# EAGLE schematic discover (EAGLE 7.4.0)
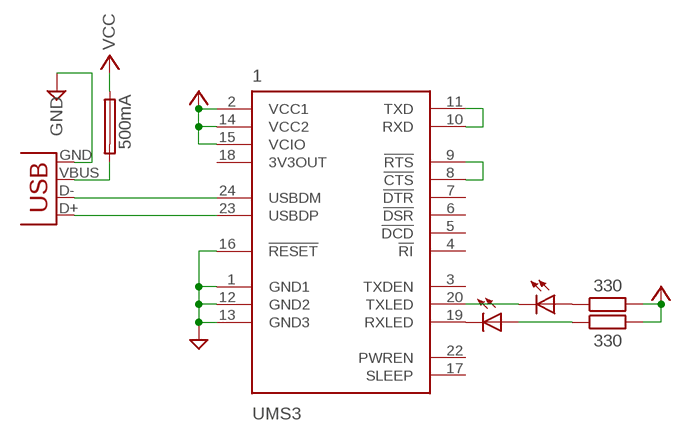
[diagram p0: schematic, sheet 1]

## Parts
1  UMS3  [DIL-24]
F1  500mA  GSH15  [GSH15]
R1  330  R-EU_0411/12  [0411/12]
R2  330  R-EU_0411/12  [0411/12]
RLED  LED3MM  [LED3MM]
TLED  LED3MM  [LED3MM]
X1  USB-PTH  [USB-B-PTH]

## Nets
GND: 1.1(GND1) 1.12(GND2) 1.13(GND3) 1.16(!RESET) X1.GND
N$1: 1.24(USBDM) X1.D-
N$2: 1.23(USBDP) X1.D+
N$3: 1.10(RXD) 1.11(TXD)
N$4: F1.2 X1.VBUS
N$5: 1.20(TXLED) TLED.K(C)
N$6: R1.1 RLED.A
N$7: 1.19(RXLED) RLED.K(C)
N$8: R2.1 TLED.A
N$9: 1.8(!CTS) 1.9(!RTS)
VCC: 1.2(VCC1) 1.14(VCC2) 1.15(VCIO) F1.1 R1.2 R2.2
Unconnected: 1.3(TXDEN) 1.4(!RI) 1.5(!DCD) 1.6(!DSR) 1.7(!DTR) 1.17(SLEEP) 1.18(3V3OUT) 1.22(PWREN)

## Library data of the parts
1 = ftdichip:UMS: Asix - UMS USB-UART Wrapper Module UMS3 is an USB->Serial interface module based on the powerful FT232RL chip made by FTDI. It enables very easy connection of the user's application to the PC via the USB port, without necessity of any deep knowledge about the complicated USB problematics. On the USB side of UMS3 there are 2 signals D+ and D-, on the opposite side there are the serial port signals (in the TTL level) with full data flow control. UMS3 is capable to transfer data at speeds up to 3 MBaud. UMS3 contains the on-chip EEPROM for storing the ID data (VID, PID, ID string) and the non-rewritable unique Serial number. UMS3 is manufactured as a DIP24 device with standard pin distance of 2.54 mm (0.1"). It can be put into standard or precision DIP socket or it can be directly soldered to user application PCB. It saves time and money in small medium volume production. The USB connector is to be connected separately, the designer has flexibility in the PCB layout and mechanical design in comparison to modules with built-in USB connector. Also, the A-type, B-type connector or even cable can be used. The UMS3 module supports all powerful features of the FT232R chip like BitBang mode, FTDIChip-ID? Security Dongle, Clock Generator Output, etc.). Another big feature is a 1.8 ... 5 V interface capability. After some minor changes in a target board, the UMS3 module can be used as an older UMS1 module replacement. The procedure is decribed in the User's Guide at http://www.asix.info.
F1 = fuse:GSH15: FUSE HOLDER grid 15mm, 19649 Wickmann
R1 R2 = rcl:R-EU_: RESISTOR, European symbol
RLED TLED = led:LED: LED OSRAM: - CHIPLED LG R971, LG N971, LY N971, LG Q971, LY Q971, LO R971, LY R971 LH N974, LH R974 LS Q976, LO Q976, LY Q976 LO Q996 - Hyper CHIPLED LW Q18S LB Q993, LB Q99A, LB R99A - SideLED LS A670, LO A670, LY A670, LG A670, LP A670 LB A673, LV A673, LT A673, LW A673 LH A674 LY A675 LS A676, LA A676, LO A676, LY A676, LW A676 LS A679, LY A679, LG A679 - Hyper Micro SIDELED® LS Y876, LA Y876, LO Y876, LY Y876 LT Y87S - SmartLED LW L88C, LW L88S LB L89C, LB L89S, LG L890 LS L89K, LO L89K, LY L89K LS L896, LA L896, LO L896, LY L896 - TOPLED LS T670, LO T670, LY T670, LG T670, LP T670 LSG T670, LSP T670, LSY T670, LOP T670, LYG T670 LG T671, LOG T671, LSG T671 LB T673, LV T673, LT T673, LW T673 LH T674 LS T676, LA T676, LO T676, LY T676, LB T676, LH T676, LSB T676, LW T676 LB T67C, LV T67C, LT T67C, LS T67K, LO T67K, LY T67K, LW E67C LS E67B, LA E67B, LO E67B, LY E67B, LB E67C, LV E67C, LT E67C LW T67C LS T679, LY T679, LG T679 LS T770, LO T770, LY T770, LG T770, LP T770 LB T773, LV T773, LT T773, LW T773 LH T774 LS E675, LA E675, LY E675, LS T675 LS T776, LA T776, LO T776, LY T776, LB T776 LHGB T686 LT T68C, LB T68C - Hyper Mini TOPLED® LB M676 - Mini TOPLED Santana® LG M470 LS M47K, LO M47K, LY M47K Source: http://www.osram.convergy.de LUXEON: - LUMILED® LXK2-PW12-R00, LXK2-PW12-S00, LXK2-PW14-U00, LXK2-PW14-V00 LXK2-PM12-R00, LXK2-PM12-S00, LXK2-PM14-U00 LXK2-PE12-Q00, LXK2-PE12-R00, LXK2-PE12-S00, LXK2-PE14-T00, LXK2-PE14-U00 LXK2-PB12-K00, LXK2-PB12-L00, LXK2-PB12-M00, LXK2-PB14-N00, LXK2-PB14-P00, LXK2-PB14-Q00 LXK2-PR12-L00, LXK2-PR12-M00, LXK2-PR14-Q00, LXK2-PR14-R00 LXK2-PD12-Q00, LXK2-PD12-R00, LXK2-PD12-S00 LXK2-PH12-R00, LXK2-PH12-S00 LXK2-PL12-P00, LXK2-PL12-Q00, LXK2-PL12-R00 Source: www.luxeon.com KINGBRIGHT: KA-3528ASYC Source: www.kingbright.com
X1 = con-usb:USB: USB Connectors USB-B-PTH is fully proven SKU : PRT-00139 USB-miniB is fully proven SKU : PRT-00587 USB-A-PCB is untested. USB-A-H is throughly reviewed, but untested. Spark Fun Electronics SKU : PRT-00437 USB-B-SMT is throughly reviewed, but untested. Needs silkscreen touching up. USB-A-S has not been used/tested USB-MB-H has not been used/tested